# Altium schematic sheet K60最小系统.SchDoc: K60最小系统
size A3; DocumentNumber: 1; Revision: V1.0; SheetNumber: 1; SheetTotal: 1; Designer: 樊浩柏
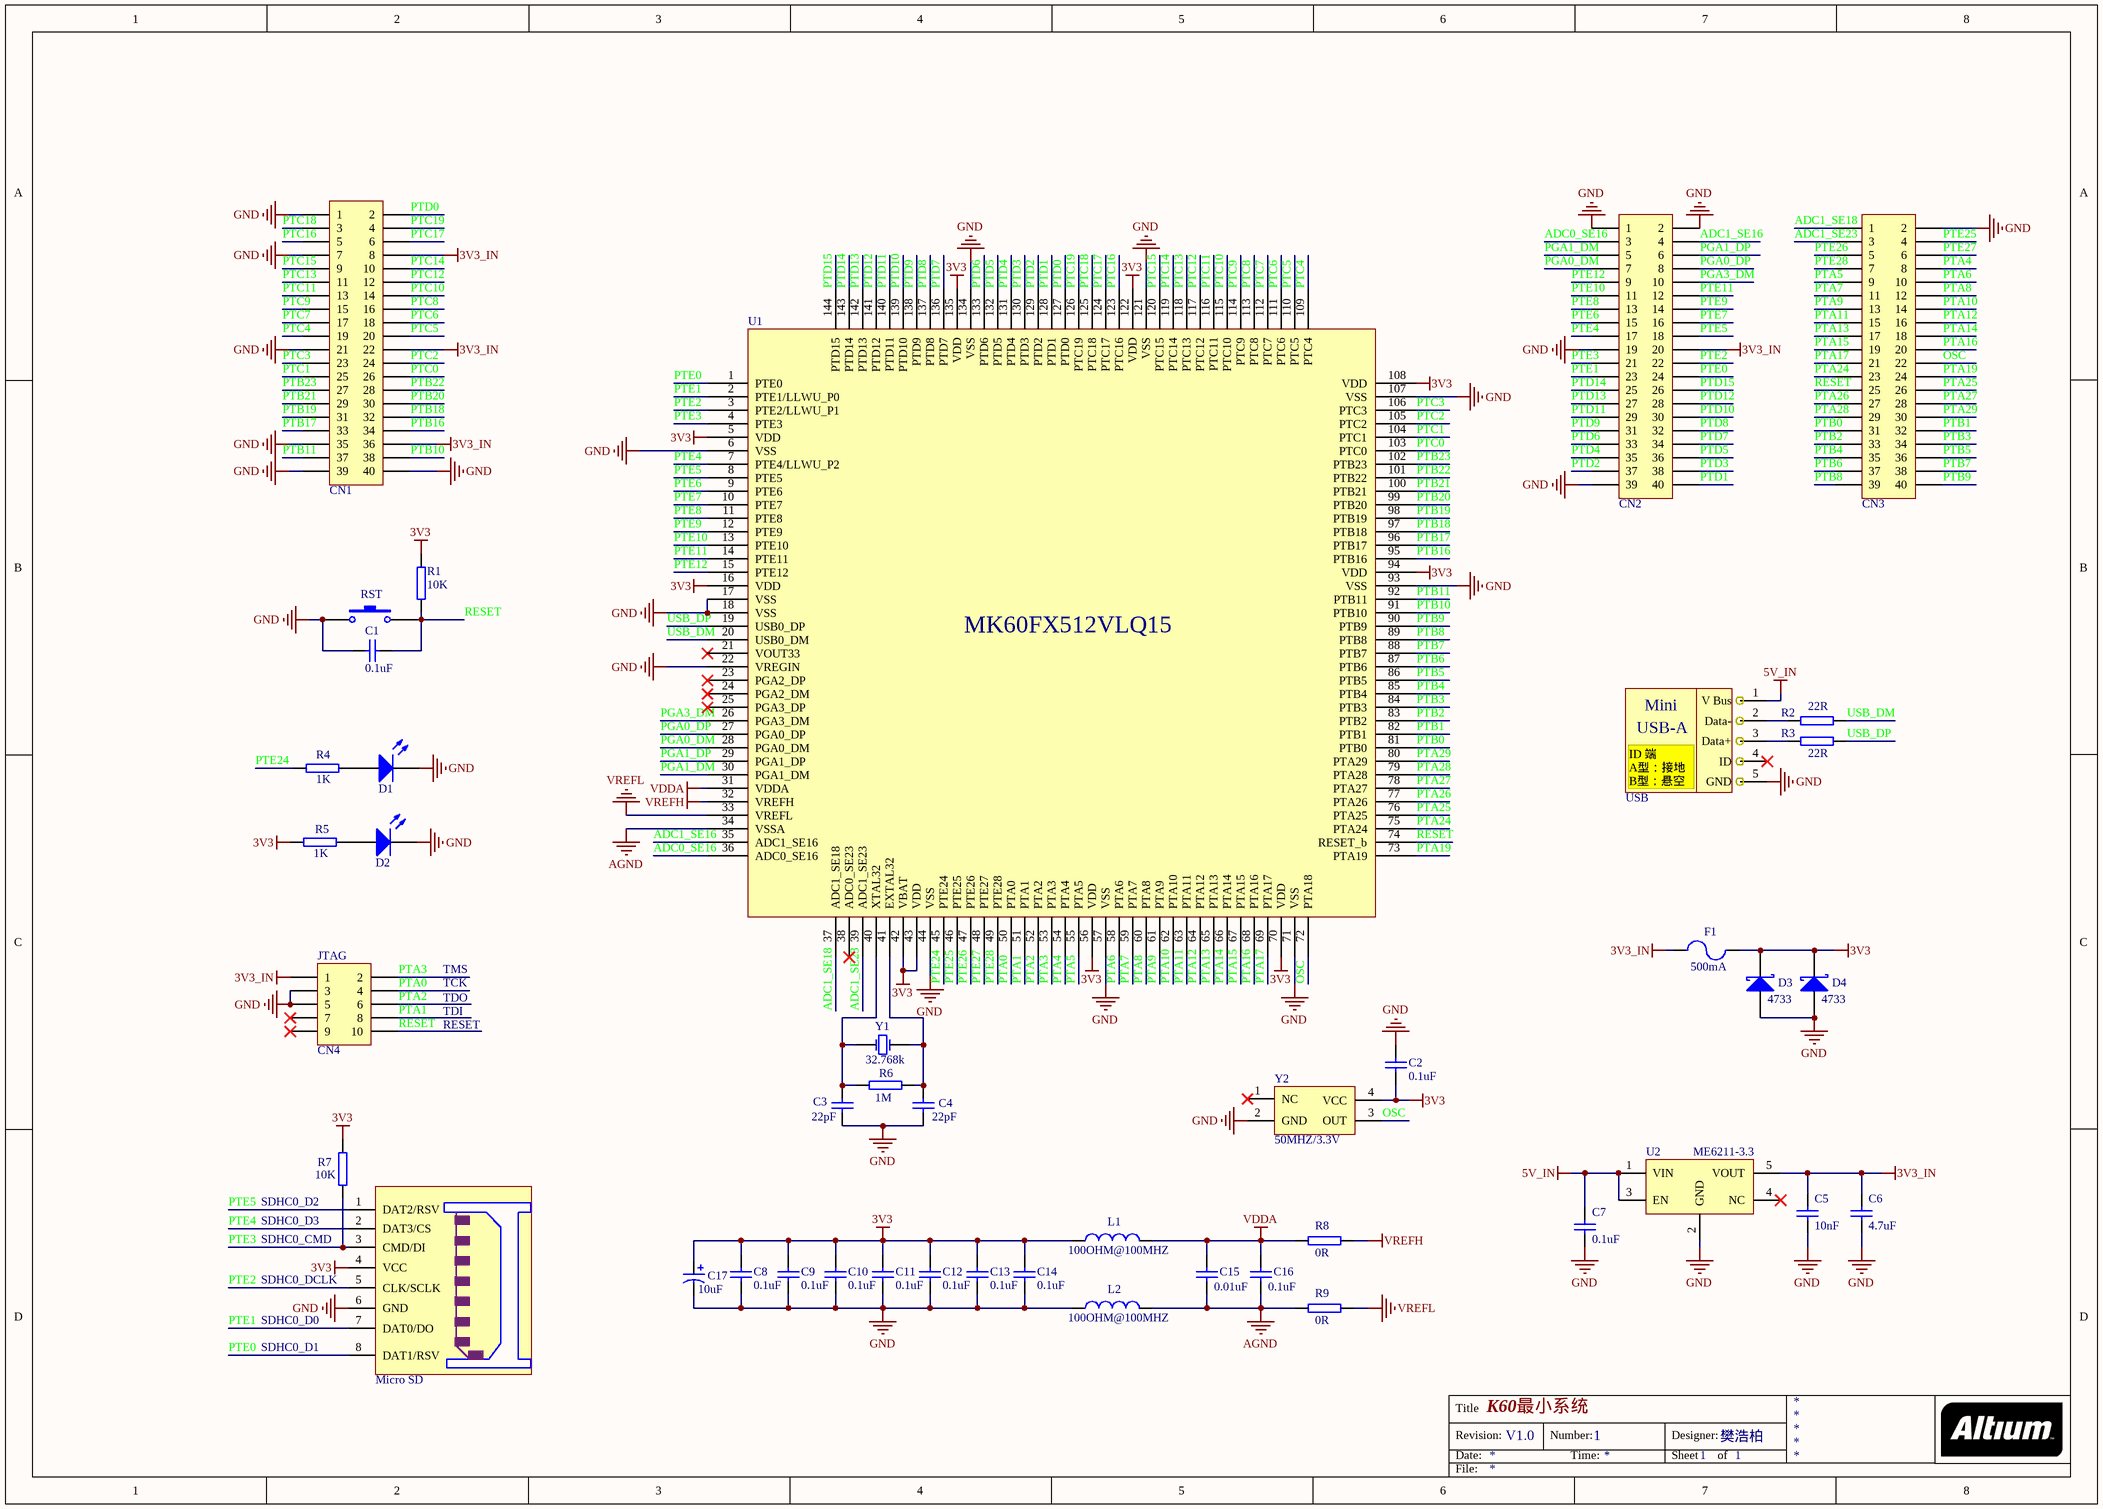
[diagram p0: K60最小系统.SchDoc]

## Parts
C1  0.1uF  [CAP-0603]
C2  0.1uF  [CAP-0603]
C3  22pF  [CAP-0603]
C4  22pF  [CAP-0603]
C5  10nF  [CAP-0603]
C6  4.7uF  [CAP-0603]
C7  0.1uF  [CAP-0603]
C8  0.1uF  [CAP-0603]
C9  0.1uF  [CAP-0603]
C10  0.1uF  [CAP-0603]
C11  0.1uF  [CAP-0603]
C12  0.1uF  [CAP-0603]
C13  0.1uF  [CAP-0603]
C14  0.1uF  [CAP-0603]
C15  0.01uF  [CAP-0603]
C16  0.1uF  [CAP-0603]
C17  10uF  [CASE-A_3216-18]
CN1  CON-20X2  [Pin-Header-2.00-Double-40]  (value not drawn)
CN2  CON-20X2  [Pin-Header-2.00-Double-40]  (value not drawn)
CN3  CON-20X2  [Pin-Header-2.00-Double-40]  (value not drawn)
CN4  JTAG  [Pin-Header-2.54-Double-10]
D1  LED  [LED-RED-0603]  (value not drawn)
D2  LED  [LED-BLU-0603]  (value not drawn)
D3  4733  [Diode-SMD-1206]
D4  4733  [Diode-SMD-1206]
F1  500mA  [Fuse-1206]
L1  100OHM@100MHZ  [Chip Inductor-0603_160808]
L2  100OHM@100MHZ  [Chip Inductor-0603_160808]
Micro_SD  SD  [Micro-SD]  (value not drawn)
R1  10K  [RES-0603]
R2  22R  [RES-0603]
R3  22R  [RES-0603]
R4  1K  [RES-0603]
R5  1K  [RES-0603]
R6  1M  [RES-0603]
R7  10K  [RES-0603]
R8  0R  [RES-0603]
R9  0R  [RES-0603]
RST  Key  [SW-PB-2]  (value not drawn)
U1  MK60FX512VLQ15  [LQFP-144-20x20mm]
U2  ME6211-3.3  [SOT-23-5]
USB  Mini-USB-A  [Mini-USB(a)-SMD]  (value not drawn)
Y1  32.768k  [XTAL-XYL-SMD]
Y2  50MHZ/3.3V  [XTAL-OSC-3225]

## Nets
3V3: C2.1 C8.2 C9.2 C10.2 C11.2 C12.2 C13.2 C14.2 C17.A D3.K D4.K F1.2 L1.1 Micro_SD.4(VCC) R1.2 R5.2 R7.2 U1.5(VDD) U1.16(VDD) U1.42(VBAT) U1.43(VDD) U1.56(VDD) U1.70(VDD) U1.94(VDD) U1.108(VDD) U1.122(VDD) U1.135(VDD) Y2.4(VCC)
3V3_IN: C5.1 C6.1 CN1.8 CN1.22 CN1.36 CN2.20 CN4.1 F1.1 U2.5(VOUT)
5V_IN: C7.1 U2.1(VIN) U2.3(EN) USB.1(V_Bus)
AGND: C15.1 C16.1 L2.2 R9.1 U1.34(VSSA)
GND: C1.2 C2.2 C3.1 C4.1 C5.2 C6.2 C7.2 C8.1 C9.1 C10.1 C11.1 C12.1 C13.1 C14.1 C17.K CN1.1 CN1.7 CN1.21 CN1.35 CN1.39 CN1.40 CN2.1 CN2.2 CN2.19 CN2.39 CN3.2 CN4.3 CN4.5 D1.K D2.K D3.A D4.A L2.1 Micro_SD.6(GND) RST.1 U1.6(VSS) U1.17(VSS) U1.18(VSS) U1.22(VREGIN) U1.44(VSS) U1.57(VSS) U1.71(VSS) U1.93(VSS) U1.107(VSS) U1.121(VSS) U1.134(VSS) U2.2(GND) USB.5(GND) Y2.2(GND)
VDDA: C15.2 C16.2 L1.2 R8.1 U1.31(VDDA)
VREFH: R8.2 U1.32(VREFH)
VREFL: R9.2 U1.33(VREFL)
ADC0_SE16: CN2.3 U1.36(ADC0_SE16)
ADC1_SE16: CN2.4 U1.35(ADC1_SE16)
ADC1_SE18: CN3.1 U1.37(ADC1_SE18)
ADC1_SE23: CN3.3 U1.39(ADC1_SE23)
OSC: CN3.22 U1.72(PTA18) Y2.3(OUT)
PGA0_DM: CN2.7 U1.28(PGA0_DM)
PGA0_DP: CN2.8 U1.27(PGA0_DP)
PGA1_DM: CN2.5 U1.30(PGA1_DM)
PGA1_DP: CN2.6 U1.29(PGA1_DP)
PGA3_DM: CN2.10 U1.26(PGA3_DM)
PTA0: CN4.4 U1.50(PTA0)
PTA1: CN4.8 U1.51(PTA1)
PTA2: CN4.6 U1.52(PTA2)
PTA3: CN4.2 U1.53(PTA3)
PTA4: CN3.8 U1.54(PTA4)
PTA5: CN3.9 U1.55(PTA5)
PTA6: CN3.10 U1.58(PTA6)
PTA7: CN3.11 U1.59(PTA7)
PTA8: CN3.12 U1.60(PTA8)
PTA9: CN3.13 U1.61(PTA9)
PTA10: CN3.14 U1.62(PTA10)
PTA11: CN3.15 U1.63(PTA11)
PTA12: CN3.16 U1.64(PTA12)
PTA13: CN3.17 U1.65(PTA13)
PTA14: CN3.18 U1.66(PTA14)
PTA15: CN3.19 U1.67(PTA15)
PTA16: CN3.20 U1.68(PTA16)
PTA17: CN3.21 U1.69(PTA17)
PTA19: CN3.24 U1.73(PTA19)
PTA24: CN3.23 U1.75(PTA24)
PTA25: CN3.26 U1.76(PTA25)
PTA26: CN3.27 U1.77(PTA26)
PTA27: CN3.28 U1.78(PTA27)
PTA28: CN3.29 U1.79(PTA28)
PTA29: CN3.30 U1.80(PTA29)
PTB0: CN3.31 U1.81(PTB0)
PTB1: CN3.32 U1.82(PTB1)
PTB2: CN3.33 U1.83(PTB2)
PTB3: CN3.34 U1.84(PTB3)
PTB4: CN3.35 U1.85(PTB4)
PTB5: CN3.36 U1.86(PTB5)
PTB6: CN3.37 U1.87(PTB6)
PTB7: CN3.38 U1.88(PTB7)
PTB8: CN3.39 U1.89(PTB8)
PTB9: CN3.40 U1.90(PTB9)
PTB10: CN1.38 U1.91(PTB10)
PTB11: CN1.37 U1.92(PTB11)
PTB16: CN1.34 U1.95(PTB16)
PTB17: CN1.33 U1.96(PTB17)
PTB18: CN1.32 U1.97(PTB18)
PTB19: CN1.31 U1.98(PTB19)
PTB20: CN1.30 U1.99(PTB20)
PTB21: CN1.29 U1.100(PTB21)
PTB22: CN1.28 U1.101(PTB22)
PTB23: CN1.27 U1.102(PTB23)
PTC0: CN1.26 U1.103(PTC0)
PTC1: CN1.25 U1.104(PTC1)
PTC2: CN1.24 U1.105(PTC2)
PTC3: CN1.23 U1.106(PTC3)
PTC4: CN1.19 U1.109(PTC4)
PTC5: CN1.20 U1.110(PTC5)
PTC6: CN1.18 U1.111(PTC6)
PTC7: CN1.17 U1.112(PTC7)
PTC8: CN1.16 U1.113(PTC8)
PTC9: CN1.15 U1.114(PTC9)
PTC10: CN1.14 U1.115(PTC10)
PTC11: CN1.13 U1.116(PTC11)
PTC12: CN1.12 U1.117(PTC12)
PTC13: CN1.11 U1.118(PTC13)
PTC14: CN1.10 U1.119(PTC14)
PTC15: CN1.9 U1.120(PTC15)
PTC16: CN1.5 U1.123(PTC16)
PTC17: CN1.6 U1.124(PTC17)
PTC18: CN1.3 U1.125(PTC18)
PTC19: CN1.4 U1.126(PTC19)
PTD0: CN1.2 U1.127(PTD0)
PTD1: CN2.40 U1.128(PTD1)
PTD2: CN2.37 U1.129(PTD2)
PTD3: CN2.38 U1.130(PTD3)
PTD4: CN2.35 U1.131(PTD4)
PTD5: CN2.36 U1.132(PTD5)
PTD6: CN2.33 U1.133(PTD6)
PTD7: CN2.34 U1.136(PTD7)
PTD8: CN2.32 U1.137(PTD8)
PTD9: CN2.31 U1.138(PTD9)
PTD10: CN2.30 U1.139(PTD10)
PTD11: CN2.29 U1.140(PTD11)
PTD12: CN2.28 U1.141(PTD12)
PTD13: CN2.27 U1.142(PTD13)
PTD14: CN2.25 U1.143(PTD14)
PTD15: CN2.26 U1.144(PTD15)
PTE0: CN2.24 Micro_SD.8(DAT1/RSV) U1.1(PTE0)
PTE1: CN2.23 Micro_SD.7(DAT0/DO) U1.2(PTE1/LLWU_P0)
PTE2: CN2.22 Micro_SD.5(CLK/SCLK) U1.3(PTE2/LLWU_P1)
PTE3: CN2.21 Micro_SD.3(CMD/DI) R7.1 U1.4(PTE3)
PTE4: CN2.17 Micro_SD.2(DAT3/CS) U1.7(PTE4/LLWU_P2)
PTE5: CN2.18 Micro_SD.1(DAT2/RSV) U1.8(PTE5)
PTE6: CN2.15 U1.9(PTE6)
PTE7: CN2.16 U1.10(PTE7)
PTE8: CN2.13 U1.11(PTE8)
PTE9: CN2.14 U1.12(PTE9)
PTE10: CN2.11 U1.13(PTE10)
PTE11: CN2.12 U1.14(PTE11)
PTE12: CN2.9 U1.15(PTE12)
PTE24: R4.2 U1.45(PTE24)
PTE25: CN3.4 U1.46(PTE25)
PTE26: CN3.5 U1.47(PTE26)
PTE27: CN3.6 U1.48(PTE27)
PTE28: CN3.7 U1.49(PTE28)
RESET: C1.1 CN3.25 CN4.10 R1.1 RST.2 U1.74(RESET_b)
USB_DM: R2.2 U1.20(USB0_DM)
USB_DP: R3.2 U1.19(USB0_DP)
NetC3_2: C3.2 R6.2 U1.40(XTAL32) Y1.1(OSC1)
NetC4_2: C4.2 R6.1 U1.41(EXTAL32) Y1.3(OSC2)
NetD1_A: D1.A R4.1
NetD2_A: D2.A R5.1
NetR2_1: R2.1 USB.2(Data-)
NetR3_1: R3.1 USB.3(Data+)

Not connected (* = marked no-connect by the designer): CN4 7* 9*; U1 21(VOUT33)* 23(PGA2_DP)* 24(PGA2_DM)* 25(PGA3_DP)* 38(ADC0_SE23)*; U2 4(NC)*; USB 4(ID)*; Y2 1(NC)*

## Notes on the sheet
- TMS
- TCK
- TDO
- TDI
- RESET
- (near R7) SDHC0_D2
- SDHC0_D3
- SDHC0_CMD
- SDHC0_DCLK
- SDHC0_D0
- SDHC0_D1
- Title
- Revision:
- Date:
- Number:
- Time:
- Designer:
- Sheet
- of
- File:
- (in symbol Mini-USB-A) Mini; USB-A; ID 端 / A型：接地 / B型：悬空

## Library data of the parts
C1-C16 = Cap
C17 = Cap-Pol_1
CN4 = CON-5X2
D3 D4 = Diode-Schottky
F1 = Fuse
L1 L2 = Inductor
Micro_SD = Micro-SD
R1-R9 = Res
RST = Key-PB-2
U1 = K60-144P
U2 = LDO: Published: 24-Mar-1999; LatestRevisionDate: 29-May-2009; LatestRevisionNote: IPC-7351 Footprint Added.; PackageReference: D2PAK; Publisher: Altium Limited; PackageDescription: 3-Pin Transistor Outline Package 2.54 mm Pitch, 15.1 mm Lead Span
Y1 = XTAL
Y2 = XTAL-OSC